# Altium project Adafruit Feather M0 Adalogger.PrjPcb
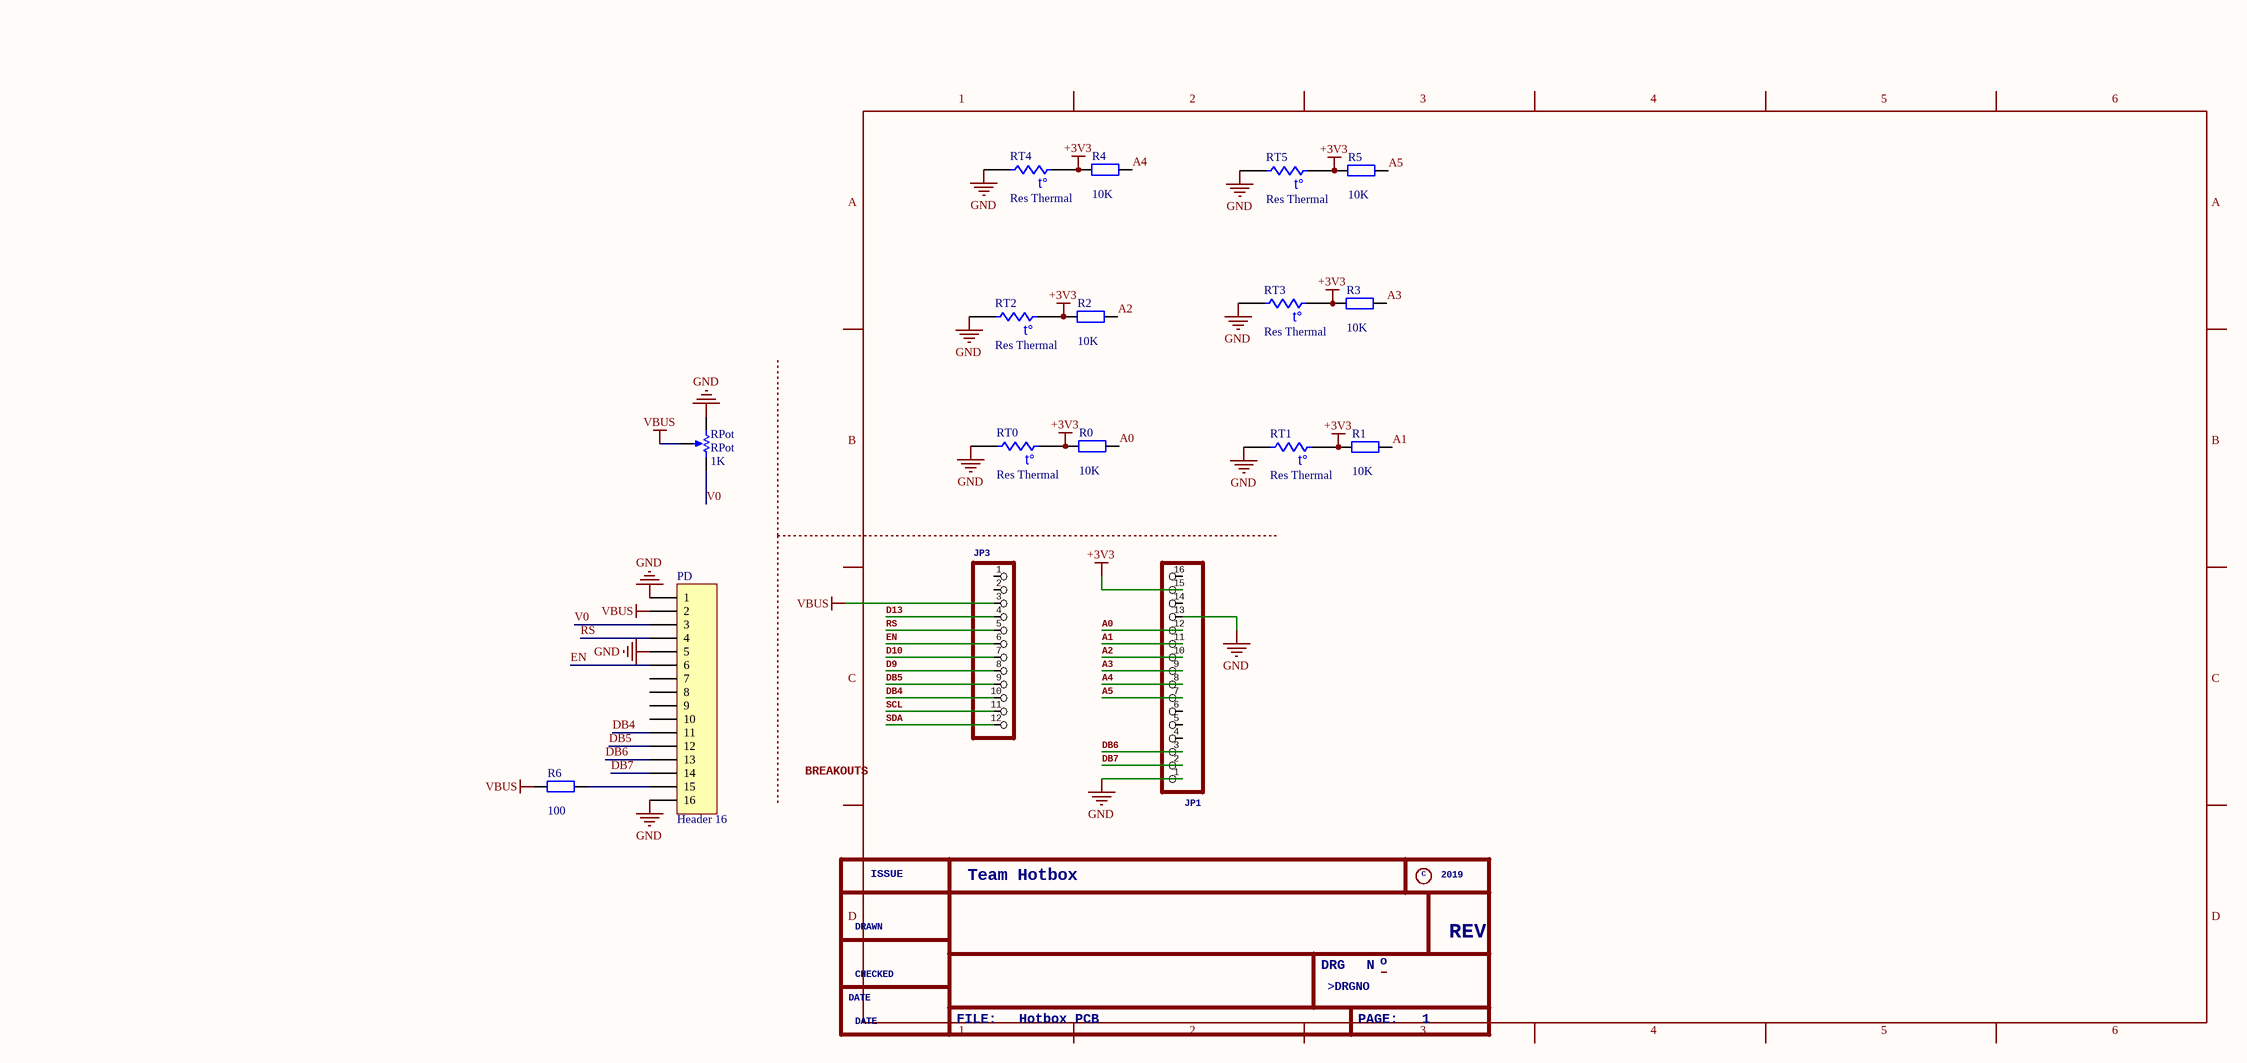
[diagram p0: Adafruit Feather M0 Adalogger.SchDoc]
1 sheet, 18 parts. Net scope: global (net labels, ports and power ports of the same name join across sheets).
Board file: Adafruit Feather M0 Adalogger.PcbDoc

## Sheet Adafruit Feather M0 Adalogger.SchDoc
size 282 x 197 mm; COMPANY: ADAFRUIT INDUSTRIES; DRAWN: KTOWN; REV: B

### Parts
FRAME1  SHEET: 1  TITLE: Hotbox PCB  COMPANY: Team Hotbox  FILE: FILE:  PAGE: PAGE:  DRGNO: >DRGNO  (hidden comment: FRAME_A4)  (part B of 2)
JP1  HEADER-1X16ROUND  [1X16_ROUND]  (value not drawn)
JP3  HEADER-1X12  [1X12_ROUND]  (value not drawn)
PD  Header 16  [HDR1X16]
R0  value 10K  [AXIAL-0.4]
R1  value 10K  [AXIAL-0.4]
R2  value 10K  [AXIAL-0.4]
R3  value 10K  [AXIAL-0.4]
R4  value 10K  [AXIAL-0.4]
R5  value 10K  [AXIAL-0.4]
R6  value 100  [AXIAL-0.4]
RPot  RPot  value 1K  [VR4]
RT0  Res Thermal  [PIN-W2/E2.8]
RT1  Res Thermal  [PIN-W2/E2.8]
RT2  Res Thermal  [PIN-W2/E2.8]
RT3  Res Thermal  [PIN-W2/E2.8]
RT4  Res Thermal  [PIN-W2/E2.8]
RT5  Res Thermal  [PIN-W2/E2.8]

### Nets
+3V3: JP1.15 R0.1 R1.1 R2.1 R3.1 R4.1 R5.1 RT0.1 RT1.1 RT2.1 RT3.1 RT4.1 RT5.1
GND: JP1.1 JP1.13 PD.1 PD.5 PD.16 RPot.1(TOP) RT0.2 RT1.2 RT2.2 RT3.2 RT4.2 RT5.2
VBUS: JP3.3 PD.2 R6.1 RPot.3(TAP)
A0: JP1.12 R0.2
A1: JP1.11 R1.2
A2: JP1.10 R2.2
A3: JP1.9 R3.2
A4: JP1.8 R4.2
A5: JP1.7 R5.2
D9: JP3.8
D10: JP3.7
D13: JP3.4
DB4: JP3.10 PD.11
DB5: JP3.9 PD.12
DB6: JP1.3 PD.13
DB7: JP1.2 PD.14
EN: JP3.6 PD.6
RS: JP3.5 PD.4
SCL: JP3.11
SDA: JP3.12
V0: PD.3 RPot.2(BOT)
NetPD_15: PD.15 R6.2

Not connected (* = marked no-connect by the designer): JP1 4 5 6 14 16; JP3 1 2; PD 7 8 9 10

### Notes on the sheet
- BREAKOUTS
- (in symbol FRAME_A4, part B) 2; 3; 4; 5; 6; A; B; D
- (in symbol Res Thermal) t°

### Library data of the parts
FRAME1 = FRAME_A4: FRAME   DIN A4, landscape with location and doc. field; GateName_1: G$1; GateName_2: G$3; SymbolName_2: FRAME_DOCFIELD; SymbolName_1: FRAME_A4; LibraryName: microbuilder; DeviceSetName: FRAME_A4; DRG: DRG; o: o; N: N; 2019: 2019; C: C; ISSUE: ISSUE; DATE: DATE; DRAWN: DRAWN; CHECKED: CHECKED; REV: REV
JP1 = HEADER-1X16ROUND: PIN HEADER; GateName_1: A; SymbolName_1: PINHD16; DeviceName: ROUND; LibraryName: microbuilder; DeviceSetName: HEADER-1X16
JP3 = HEADER-1X12: GateName_1: G$1; SymbolName_1: PINHD12; LibraryName: microbuilder; DeviceSetName: HEADER-1X12
PD = Header 16: Header, 16-Pin; LatestRevisionDate: 17-Jul-2002; LatestRevisionNote: Re-released for DXP Platform.; Publisher: Altium Limited
R0-R6 = Res2: Resistor; Published: 8-Jun-2000; LatestRevisionDate: 17-Jul-2002; LatestRevisionNote: Re-released for DXP Platform.; PackageReference: AXIAL-0.4; Publisher: Altium Limited; PackageDescription: Axial Device, Thru-Hole; 2 Leads; 0.4 in Pin Spacing
RPot = RPot: Potentiometer; Sim Note: Enter the Resistance value and the set point into parameter fields.; Set Position: 0.5; Published: 8-Jun-2000; LatestRevisionDate: 17-Jul-2002; LatestRevisionNote: Re-released for DXP Platform.; PackageReference: VR5; Publisher: Altium Limited; PackageDescription: Variable Resistor, Thru-Hole; 3 Leads
RT0-RT5 = Res Thermal: Thermistor; Published: 24-Mar-1999; LatestRevisionDate: 29-May-2009; LatestRevisionNote: IPC-7351 Footprint Added.; PackageVersion: Mar-2003; PackageReference: 6-0805; Publisher: Altium Limited; PackageDescription: Chip Resistor 0805 Case Size; Code_IPC: RESC2012